# Altium schematic sheet 3_mpcie.SchDoc: Mini-PCIe connectors
size A4; OrganizationName: Pluton UPV; Address1: Universitat Politècnica; Address2: de València (UPV); Address3: Camí de Vera, València; Address4: Spain; SheetNumber: 3; SheetTotal: 8
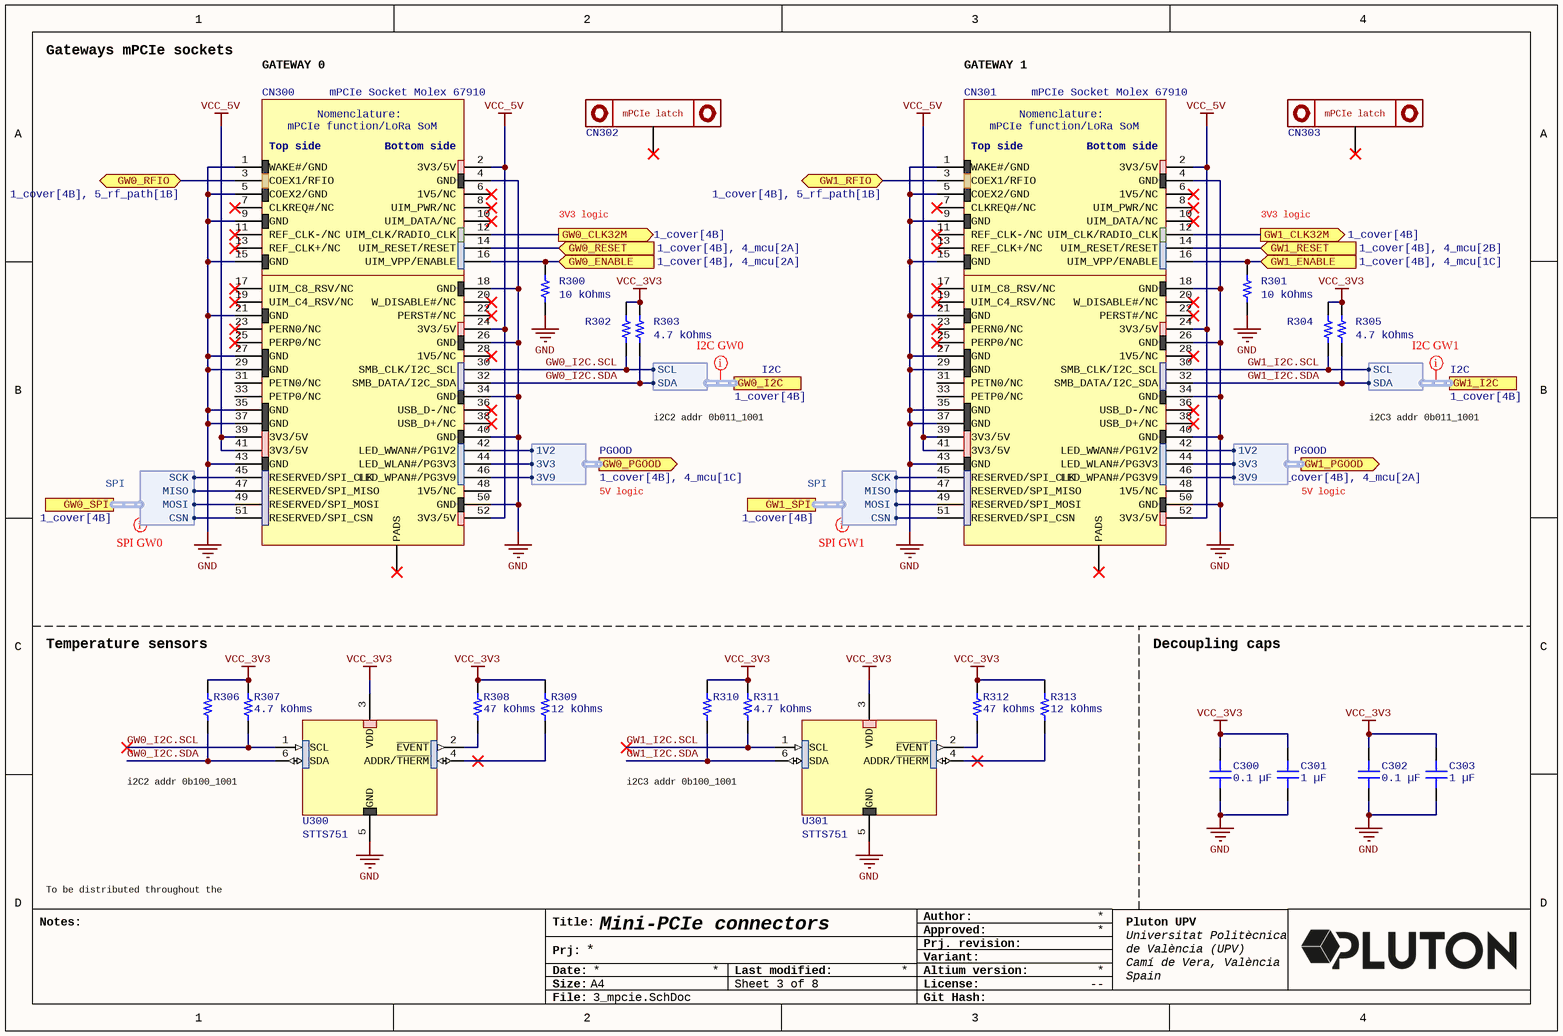
[diagram p0: 3_mpcie.SchDoc]

## Parts
C300  0.1 µF  [CAP 0402_1005]
C301  1 µF  [CAP 0402_1005]
C302  0.1 µF  [CAP 0402_1005]
C303  1 µF  [CAP 0402_1005]
CN300  mPCIe Socket Molex 67910  [mPCIe Socket Molex 67910]
CN301  mPCIe Socket Molex 67910  [mPCIe Socket Molex 67910]
CN302  mPCIe Latch Molex 48099  [MPCIE LATCH MOLEX 48099]  (value not drawn)
CN303  mPCIe Latch Molex 48099  [MPCIE LATCH MOLEX 48099]  (value not drawn)
R300  10 kOhms  [RES 0201_0603]
R301  10 kOhms  [RES 0201_0603]
R302  4.7 kOhms  [RES 0201_0603]  (value not drawn)
R303  4.7 kOhms  [RES 0201_0603]
R304  4.7 kOhms  [RES 0201_0603]  (value not drawn)
R305  4.7 kOhms  [RES 0201_0603]
R306  4.7 kOhms  [RES 0201_0603]  (value not drawn)
R307  4.7 kOhms  [RES 0201_0603]
R308  47 kOhms  [RES 0201_0603]
R309  12 kOhms  [RES 0201_0603]
R310  4.7 kOhms  [RES 0201_0603]  (value not drawn)
R311  4.7 kOhms  [RES 0201_0603]
R312  47 kOhms  [RES 0201_0603]
R313  12 kOhms  [RES 0201_0603]
U300  STTS751  [UDFN-6L]
U301  STTS751  [UDFN-6L]

## Ports
GW0_CLK32M (out, see 1_cover[4B]), GW0_ENABLE (in, see 1_cover[4B], 4_mcu[2A]), GW0_I2C (harness I2C, see 1_cover[4B]), GW0_PGOOD (out, harness PGOOD, see 1_cover[4B], 4_mcu[1C]), GW0_RESET (in, see 1_cover[4B], 4_mcu[2A]), GW0_RFIO (bidir, see 1_cover[4B], 5_rf_path[1B]), GW0_SPI (harness SPI, see 1_cover[4B]), GW1_CLK32M (out, see 1_cover[4B]), GW1_ENABLE (in, see 1_cover[4B], 4_mcu[1C]), GW1_I2C (harness I2C, see 1_cover[4B]), GW1_PGOOD (out, harness PGOOD, see 1_cover[4B], 4_mcu[2A]), GW1_RESET (in, see 1_cover[4B], 4_mcu[2B]), GW1_RFIO (bidir, see 1_cover[4B], 5_rf_path[1B]), GW1_SPI (harness SPI, see 1_cover[4B])

## Harnesses
SPI: SCK, MISO, MOSI, CSN
I2C: SCL, SDA
PGOOD: 1V2, 3V3, 3V9

## Nets
GND: C300.1 C301.1 C302.1 C303.1 CN300.1(WAKE#/GND) CN300.4(GND) CN300.5(COEX2/GND) CN300.9(GND) CN300.15(GND) CN300.18(GND) CN300.21(GND) CN300.26(GND) CN300.27(GND) CN300.29(GND) CN300.34(GND) CN300.35(GND) CN300.37(GND) CN300.40(GND) CN300.43(GND) CN300.50(GND) CN301.1(WAKE#/GND) CN301.4(GND) CN301.5(COEX2/GND) CN301.9(GND) CN301.15(GND) CN301.18(GND) CN301.21(GND) CN301.26(GND) CN301.27(GND) CN301.29(GND) CN301.34(GND) CN301.35(GND) CN301.37(GND) CN301.40(GND) CN301.43(GND) CN301.50(GND) R300.1 R301.1 U300.5(GND) U301.5(GND)
VCC_3V3: C300.2 C301.2 C302.2 C303.2 R302.2 R303.2 R304.2 R305.2 R306.2 R307.2 R308.2 R309.2 R310.2 R311.2 R312.2 R313.2 U300.3(VDD) U301.3(VDD)
VCC_5V: CN300.2(3V3/5V) CN300.24(3V3/5V) CN300.39(3V3/5V) CN300.41(3V3/5V) CN300.52(3V3/5V) CN301.2(3V3/5V) CN301.24(3V3/5V) CN301.39(3V3/5V) CN301.41(3V3/5V) CN301.52(3V3/5V)
GW0_CLK32M: CN300.12(UIM_CLK/RADIO_CLK) ; port GW0_CLK32M
GW0_ENABLE: CN300.16(UIM_VPP/ENABLE) R300.2 ; port GW0_ENABLE
GW0_I2C.SCL: CN300.30(SMB_CLK/I2C_SCL) R302.1 R307.1 U300.1(SCL) ; port GW0_I2C.SCL
GW0_I2C.SDA: CN300.32(SMB_DATA/I2C_SDA) R303.1 R306.1 U300.6(SDA) ; port GW0_I2C.SDA
GW0_RESET: CN300.14(UIM_RESET/RESET) ; port GW0_RESET
GW0_RFIO: CN300.3(COEX1/RFIO) ; port GW0_RFIO
GW1_CLK32M: CN301.12(UIM_CLK/RADIO_CLK) ; port GW1_CLK32M
GW1_ENABLE: CN301.16(UIM_VPP/ENABLE) R301.2 ; port GW1_ENABLE
GW1_I2C.SCL: CN301.30(SMB_CLK/I2C_SCL) R304.1 R311.1 U301.1(SCL) ; port GW1_I2C.SCL
GW1_I2C.SDA: CN301.32(SMB_DATA/I2C_SDA) R305.1 R310.1 U301.6(SDA) ; port GW1_I2C.SDA
GW1_RESET: CN301.14(UIM_RESET/RESET) ; port GW1_RESET
GW1_RFIO: CN301.3(COEX1/RFIO) ; port GW1_RFIO
NetCN300_42: CN300.42(LED_WWAN#/PG1V2) ; port GW0_PGOOD.1V2
NetCN300_44: CN300.44(LED_WLAN#/PG3V3) ; port GW0_PGOOD.3V3
NetCN300_45: CN300.45(RESERVED/SPI_CLK) ; port GW0_SPI.SCK
NetCN300_46: CN300.46(LED_WPAN#/PG3V9) ; port GW0_PGOOD.3V9
NetCN300_47: CN300.47(RESERVED/SPI_MISO) ; port GW0_SPI.MISO
NetCN300_49: CN300.49(RESERVED/SPI_MOSI) ; port GW0_SPI.MOSI
NetCN300_51: CN300.51(RESERVED/SPI_CSN) ; port GW0_SPI.CSN
NetCN301_42: CN301.42(LED_WWAN#/PG1V2) ; port GW1_PGOOD.1V2
NetCN301_44: CN301.44(LED_WLAN#/PG3V3) ; port GW1_PGOOD.3V3
NetCN301_45: CN301.45(RESERVED/SPI_CLK) ; port GW1_SPI.SCK
NetCN301_46: CN301.46(LED_WPAN#/PG3V9) ; port GW1_PGOOD.3V9
NetCN301_47: CN301.47(RESERVED/SPI_MISO) ; port GW1_SPI.MISO
NetCN301_49: CN301.49(RESERVED/SPI_MOSI) ; port GW1_SPI.MOSI
NetCN301_51: CN301.51(RESERVED/SPI_CSN) ; port GW1_SPI.CSN
NetR308_1: R308.1 U300.2(~{EVENT})
NetR309_1: R309.1 U300.4(ADDR/~{THERM})
NetR312_1: R312.1 U301.2(~{EVENT})
NetR313_1: R313.1 U301.4(ADDR/~{THERM})

Not connected (* = marked no-connect by the designer): CN300 0(PADS)* 6(1V5/NC)* 7(CLKREQ#/NC)* 8(UIM_PWR/NC)* 10(UIM_DATA/NC)* 11(REF_CLK-/NC)* 13(REF_CLK+/NC)* 17(UIM_C8_RSV/NC)* 19(UIM_C4_RSV/NC)* 20(W_DISABLE#/NC)* 22(PERST#/NC)* 23(PERN0/NC)* 25(PERP0/NC)* 28(1V5/NC)* 31(PETN0/NC) 33(PETP0/NC) 36(USB_D-/NC)* 38(USB_D+/NC)* 48(1V5/NC); CN301 0(PADS)* 6(1V5/NC)* 7(CLKREQ#/NC)* 8(UIM_PWR/NC)* 10(UIM_DATA/NC)* 11(REF_CLK-/NC)* 13(REF_CLK+/NC)* 17(UIM_C8_RSV/NC)* 19(UIM_C4_RSV/NC)* 20(W_DISABLE#/NC)* 22(PERST#/NC)* 23(PERN0/NC)* 25(PERP0/NC)* 28(1V5/NC)* 31(PETN0/NC) 33(PETP0/NC) 36(USB_D-/NC)* 38(USB_D+/NC)* 48(1V5/NC); CN302 1*; CN303 1*

## Layout directives
net class SPI GW0; rule Matched Net Lengths [Tolerance = 20mm]: (no net found under the mark)
net class SPI GW1; rule Matched Net Lengths [Tolerance = 20mm]: (no net found under the mark)
net class I2C GW0; rule Matched Net Lengths [Tolerance = 20mm]: (no net found under the mark)
net class I2C GW1; rule Matched Net Lengths [Tolerance = 20mm]: (no net found under the mark)

## Notes on the sheet
- Gateways mPCIe sockets
- GATEWAY 0
- GATEWAY 1
- 3V3 logic
- i2C2 addr 0b011_1001 (0x39)
- i2C3 addr 0b011_1001 (0x39)
- 5V logic
- (near R306) Temperature sensors
- Decoupling caps
- (near U300) i2C2 addr 0b100_1001 (0x49)
- (near U301) i2C3 addr 0b100_1001 (0x49)
- To be distributed throughout the board
- Notes:
- Title:
- Author:
- Approved:
- Date:
- Prj:
- Size:
- A4
- Last modified:
- Altium version:
- Variant:
- Prj. revision:
- License:
- --
- File:
- Git Hash:
- (in symbol MiniPCIe Socket) Nomenclature: / mPCIe function/LoRa SoM function; Top side; Bottom side
- (in symbol MiniPCIe Socket latch) mPCIe latch

## Library data of the parts
C300 C302 = C0402C104K4RECAUTO: CAP CER 0402 0.1UF 16V X7R 10%; manufacturer: KEMET; Part Number: C0402C104K4RECAUTO; Value: 0.1 µF; Applications: Automotive, ESD Protection; Capacitance: 0.1 µF; componentlink1description: Datasheet; componentlink1url: https://api.kemet.com/component-edge/download/datasheet/C0402C104K4RECAUTO.pdf; componentlink2description: DigiKey Link; componentlink2url: https://www.digikey.com/en/products/detail/kemet/C0402C104K4RECAUTO/8563695; Device Package: 0402 (1005 Metric); lastupdated: 09/02/2024 20:04:38; Lifecycle Status: Active; Minimum Order: 1; Mounting Type: Surface Mount, MLCC; Operating Temperature: -55°C ~ 125°C; Package / Case: 0402 (1005 Metric); packaging: TapeAndReel; partid: 1731; Part Status: Active; price: 0.01; Ratings: AEC-Q200; series: ESD SMD Auto X7R; Size / Dimension: 0.039" L x 0.020" W (1.00mm x 0.50mm); Supplier 1: DigiKey; Supplier Part Number 1: 399-17167-1-ND; Temperature Coefficient: X7R; Thickness (Max): 0.022" (0.55mm); Tolerance: ±10%; Voltage - Rated: 16V
C301 C303 = GRT155C71A105KE13D: CAP CER 1UF 10V X7S 0402; manufacturer: Murata Electronics; Tolerance: ±10%; Part Number: GRT155C71A105KE13D; Value: 1 µF; Applications: Automotive; Capacitance: 1 µF; componentlink1description: Datasheet; componentlink1url: https://search.murata.co.jp/Ceramy/image/img/A01X/G101/ENG/GRT155C71A105KE13-01.pdf; componentlink2description: DigiKey Link; componentlink2url: https://www.digikey.com/en/products/detail/murata-electronics/GRT155C71A105KE13D/10695747; Device Package: 0402 (1005 Metric); lastupdated: 09/02/2024 20:04:05; Lifecycle Status: Active; Minimum Order: 1; Mounting Type: Surface Mount, MLCC; Operating Temperature: -55°C ~ 125°C; Package / Case: 0402 (1005 Metric); packaging: TapeAndReel; partid: 47127; Part Status: Active; price: 0.04; Ratings: AEC-Q200; series: GRT; Size / Dimension: 0.039" L x 0.020" W (1.00mm x 0.50mm); Supplier 1: DigiKey; Supplier Part Number 1: 490-GRT155C71A105KE13DCT-ND; Temperature Coefficient: X7S; Thickness (Max): 0.024" (0.60mm); Voltage - Rated: 10V
CN300 CN301 = MiniPCIe Socket: System: Connector
CN302 CN303 = MiniPCIe Socket latch
R300 R301 = AF0201FR-0710KL: RES SMD 10K OHM 1% 1/20W 0201; Manufacturer: Yageo; Power (Watts): 0.05W, 1/20W; Temperature Coefficient: ±200ppm/°C; Part Number: AF0201FR-0710KL; Value: 10 kOhms; ComponentLink1Description: Datasheet; ComponentLink1URL: https://www.yageo.com/upload/media/product/productsearch/datasheet/rchip/PYu-AF_51_RoHS_L_9.pdf; ComponentLink2Description: DigiKey Link; ComponentLink2URL: https://www.digikey.com/en/products/detail/yageo/AF0201FR-0710KL/5900138; Composition: Thick Film; Device Package: 0201 (0603 Metric); Features: Anti-Sulfur, Automotive AEC-Q200; Height - Seated (Max): 0.010" (0.26mm); LastUpdated: 04/06/2024 19:11:47; Lifecycle Status: Active; Minimum Order: 1; Number of Terminations: 2; Operating Temperature: -55°C ~ 125°C; Package / Case: 0201 (0603 Metric); Packaging: TapeAndReel; PartId: 78061; Part Status: Active; Price: 0.01; Ratings: AEC-Q200; Resistance: 10 kOhms; Series: AF; Size / Dimension: 0.024" L x 0.012" W (0.60mm x 0.30mm); Supplier 1: DigiKey; Supplier Part Number 1: 13-AF0201FR-0710KLCT-ND; Supplier Device Package: 0201; Tolerance: ±1%
R302-R307 R310 R311 = AC0201FR-074K7L: RES SMD 4.7K OHM 1% 1/20W 0201; Manufacturer: Yageo; Power (Watts): 0.05W, 1/20W; Temperature Coefficient: ±200ppm/°C; Part Number: AC0201FR-074K7L; Value: 4.7 kOhms; ComponentLink1Description: Datasheet; ComponentLink1URL: https://www.yageo.com/upload/media/product/productsearch/datasheet/rchip/PYu-AC_51_RoHS_L_7.pdf; ComponentLink2Description: DigiKey Link; ComponentLink2URL: https://www.digikey.com/en/products/detail/yageo/AC0201FR-074K7L/5894686; Composition: Thick Film; Device Package: 0201 (0603 Metric); Features: Automotive AEC-Q200, Moisture Resistant; Height - Seated (Max): 0.010" (0.26mm); LastUpdated: 04/06/2024 19:11:59; Lifecycle Status: Active; Minimum Order: 1; Number of Terminations: 2; Operating Temperature: -55°C ~ 155°C; Package / Case: 0201 (0603 Metric); Packaging: CutTape; PartId: 978; Part Status: Active; Price: 0.01; Ratings: AEC-Q200; Resistance: 4.7 kOhms; Series: AC; Size / Dimension: 0.024" L x 0.012" W (0.60mm x 0.30mm); Supplier 1: DigiKey; Supplier Part Number 1: YAG3426CT-ND; Supplier Device Package: 0201; Tolerance: ±1%
R308 R312 = AC0201FR-0747KL: RES SMD 47K OHM 1% 1/20W 0201; Manufacturer: Yageo; Power (Watts): 0.05W, 1/20W; Temperature Coefficient: ±200ppm/°C; Part Number: AC0201FR-0747KL; Value: 47 kOhms; ComponentLink1Description: Datasheet; ComponentLink1URL: https://www.yageo.com/upload/media/product/productsearch/datasheet/rchip/PYu-AC_51_RoHS_L_7.pdf; ComponentLink2Description: DigiKey Link; ComponentLink2URL: https://www.digikey.com/en/products/detail/yageo/AC0201FR-0747KL/5894664; Composition: Thick Film; Device Package: 0201 (0603 Metric); Features: Automotive AEC-Q200, Moisture Resistant; Height - Seated (Max): 0.010" (0.26mm); LastUpdated: 04/06/2024 19:11:58; Lifecycle Status: Active; Minimum Order: 1; Number of Terminations: 2; Operating Temperature: -55°C ~ 155°C; Package / Case: 0201 (0603 Metric); Packaging: TapeAndReel; PartId: 1633; Part Status: Active; Price: 0.01; Ratings: AEC-Q200; Resistance: 47 kOhms; Series: AC; Size / Dimension: 0.024" L x 0.012" W (0.60mm x 0.30mm); Supplier 1: DigiKey; Supplier Part Number 1: YAG3425CT-ND; Supplier Device Package: 0201; Tolerance: ±1%
R309 R313 = CRCW020112K0FNED: RES SMD 12K OHM 1% 1/20W 0201; Manufacturer: Vishay Dale; Power (Watts): 0.05W, 1/20W; Temperature Coefficient: ±200ppm/°C; Part Number: CRCW020112K0FNED; Value: 12 kOhms; ComponentLink1Description: Datasheet; ComponentLink1URL: http://www.vishay.com/docs/20052/crcw0201e3.pdf; ComponentLink2Description: DigiKey Link; ComponentLink2URL: https://www.digikey.com/en/products/detail/vishay-dale/CRCW020112K0FNED/1199920; Composition: Thick Film; Device Package: 0201 (0603 Metric); Height - Seated (Max): 0.010" (0.26mm); LastUpdated: 04/06/2024 19:11:56; Lifecycle Status: Active; Minimum Order: 1; Number of Terminations: 2; Operating Temperature: -55°C ~ 155°C; Package / Case: 0201 (0603 Metric); Packaging: TapeAndReel; PartId: 2144; Part Status: Active; Price: 0.01; Resistance: 12 kOhms; Series: CRCW0201 e3; Size / Dimension: 0.024" L x 0.012" W (0.60mm x 0.30mm); Supplier 1: DigiKey; Supplier Part Number 1: 541-CRCW020112K0FNEDCT-ND; Supplier Device Package: 201; Tolerance: ±1%
U300 U301 = STTS751: 2.25 V low-voltage local digital temperature sensor